# Altium project koosh_sd_card_base.PrjPcb
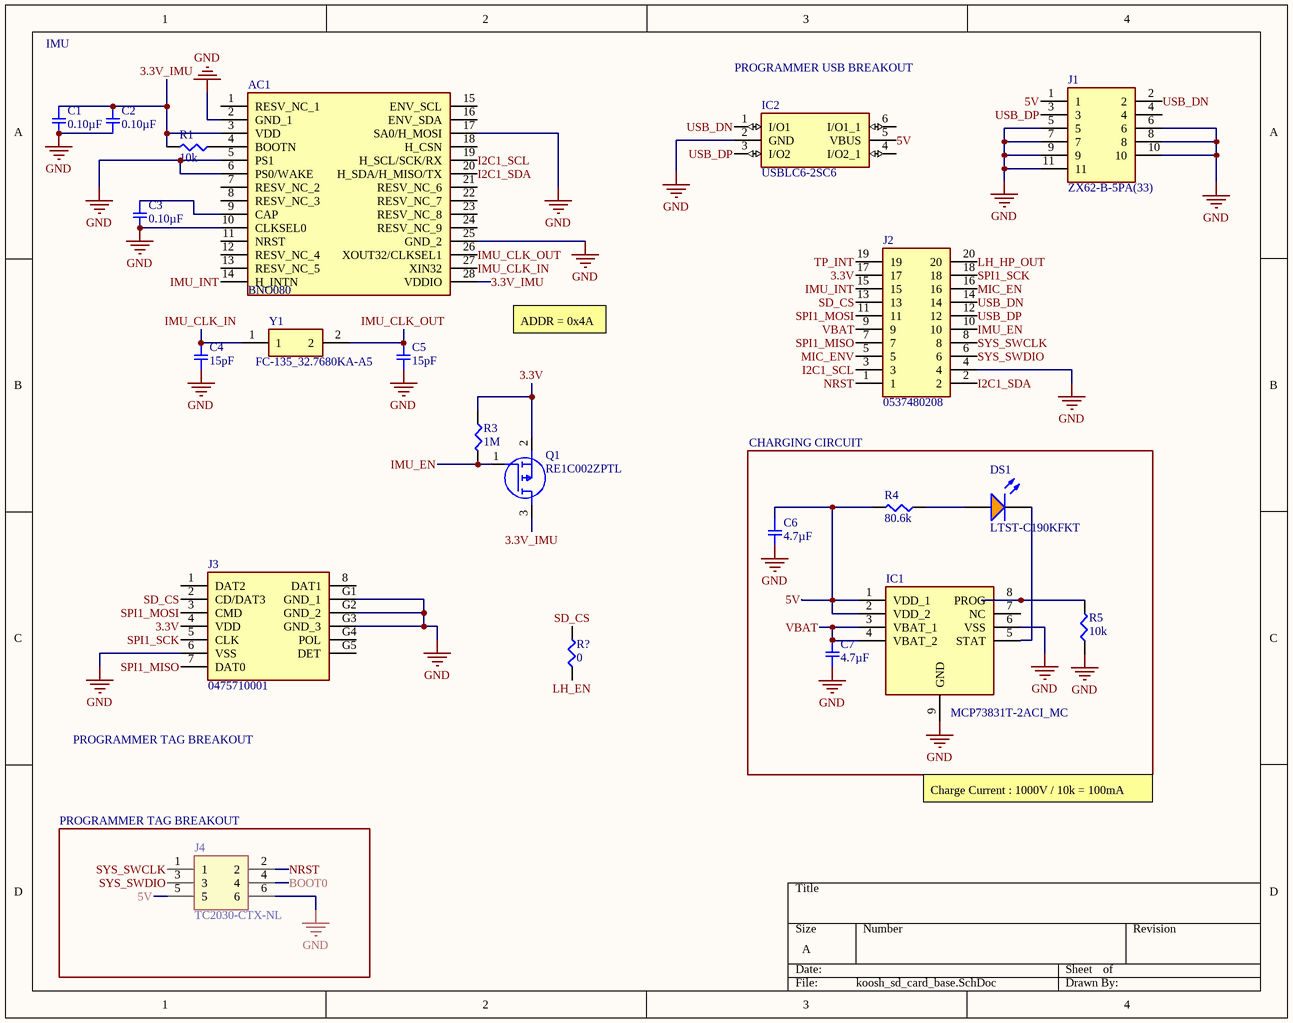
[diagram p0: koosh_sd_card_base.SchDoc]
1 sheet, 22 parts. Net scope: global (net labels, ports and power ports of the same name join across sheets).
Board file: koosh_sd_card_base_v1_1.PcbDoc

## Sheet koosh_sd_card_base.SchDoc
size A

### Parts
AC1  BNO080  [BNO080]
C1  0.10µF  [CAPC1005X55N]
C2  0.10µF  [CAPC1005X55N]
C3  0.10µF  [CAPC1005X55N]
C4  15pF  [CAPC1005X55N]
C5  15pF  [CAPC1005X55N]
C6  4.7µF  [SMD-0402C]
C7  4.7µF  [SMD-0402C]
DS1  LTST-C190KFKT  [LTST-C190KFKT_V]
IC1  MCP73831T-2ACI_MC  [SON65P300X300X100-9N-D]
IC2  USBLC6-2SC6  [SOT95P280X145-6N]
J1  ZX62-B-5PA(33)  [ZX62B5PA33]
J2  0537480208  [0537480208]
J3  0475710001  [0475710001]
J4  TC2030-CTX-NL  [TC2030MCPNL10]
Q1  RE1C002ZPTL  [SOTFL50P160X85-3N]
R1  10k  [SMD-0402-RES]
R3  1M  [SMD-0402-RES]
R4  80.6k  [SMD-0402-RES]
R5  10k  [SMD-0402-RES]
R?  0  [SMD-0402-RES]
Y1  FC-135_32.7680KA-A5  [FC135327680KAAG0]

### Blocks framed on the sheet
CHARGING CIRCUIT: C6 C7 DS1 IC1 R4 R5
PROGRAMMER TAG BREAKOUT: J4

### Nets
GND: AC1.2(GND_1) AC1.5(PS1) AC1.6(PS0/WAKE) AC1.10(CLKSEL0) AC1.17(SA0/H_MOSI) AC1.25(GND_2) C1.2 C2.2 C3.2 C4.2 C5.2 C6.2 C7.2 IC1.6(VSS) IC1.9(GND) IC2.2(GND) J1.5 J1.6 J1.7 J1.8 J1.9 J1.10 J1.11 J2.4 J3.6(VSS) J3.G1(GND_1) J3.G2(GND_2) J3.G3(GND_3) J4.6 R5.1
3.3V: J2.17 J3.4(VDD) Q1.2(S) R3.1
3.3V_IMU: AC1.3(VDD) AC1.28(VDDIO) C1.1 C2.1 Q1.3(D) R1.2
5V: C6.1 IC1.1(VDD_1) IC1.2(VDD_2) IC2.5(VBUS) J1.1 J4.5 R4.2
BOOT0: J4.4
I2C1_SCL: AC1.19(H_SCL/SCK/RX) J2.3
I2C1_SDA: AC1.20(H_SDA/H_MISO/TX) J2.2
IMU_CLK_IN: AC1.27(XIN32) C4.1 Y1.1
IMU_CLK_OUT: AC1.26(XOUT32/CLKSEL1) C5.1 Y1.2
IMU_EN: J2.10 Q1.1(G) R3.2
IMU_INT: AC1.14(H_INTN) J2.15
LH_EN: R?.1
LH_HP_OUT: J2.20
MIC_EN: J2.16
MIC_ENV: J2.5
NRST: J2.1 J4.2
SD_CS: J2.13 J3.2(CD/DAT3) R?.2
SPI1_MISO: J2.7 J3.7(DAT0)
SPI1_MOSI: J2.11 J3.3(CMD)
SPI1_SCK: J2.18 J3.5(CLK)
SYS_SWCLK: J2.8 J4.1
SYS_SWDIO: J2.6 J4.3
TP_INT: J2.19
USB_DN: IC2.1(I/O1) J1.2 J2.14
USB_DP: IC2.3(I/O2) J1.3 J2.12
VBAT: C7.1 IC1.3(VBAT_1) IC1.4(VBAT_2) J2.9
NetAC1_4: AC1.4(BOOTN) R1.1
NetAC1_9: AC1.9(CAP) C3.1
NetDS1_1: DS1.1(A) R4.1
NetDS1_2: DS1.2(K) IC1.5(STAT)
NetIC1_8: IC1.8(PROG) R5.2

Not connected (* = marked no-connect by the designer): AC1 1(RESV_NC_1) 7(RESV_NC_2) 8(RESV_NC_3) 11(NRST) 12(RESV_NC_4) 13(RESV_NC_5) 15(ENV_SCL) 16(ENV_SDA) 18(H_CSN) 21(RESV_NC_6) 22(RESV_NC_7) 23(RESV_NC_8) 24(RESV_NC_9); IC1 7(NC); IC2 4(I/O2_1) 6(I/O1_1); J1 4; J3 1(DAT2) 8(DAT1) G4(POL) G5(DET)

### Notes on the sheet
- IMU
- (near IC2) PROGRAMMER USB BREAKOUT
- ADDR = 0x4A
- PROGRAMMER TAG BREAKOUT
- Charge Current : 1000V / 10k = 100mA

### Library data of the parts
AC1 = BNO080: Accelerometer; Manufacturer_Name: Hillcrest Laboratories; Datasheet Link: http://www.hillcrestlabs.com/download/5a05f340566d07c196001ec1; Height: 1.18mm; Manufacturer_Part_Number: BNO080
C1-C3 = GCM155R71C104KA55D: CAP CER 0.1UF 16V X7R 0402; Manufacturer: Murata Electronics North America; Factory Stock: 0; Unit Price (USD): 0.1; Minimum Quantity: 1; Tolerance: ±10%; Datasheets: http://www.murata.com/~/media/webrenewal/support/library/catalog/products/capacitor/mlcc/c03e.ashx; Image: //media.digikey.com/Renders/Murata%20Renders/ZRB-SERIES-0402.jpg; Digi-Key Part Number: 490-4759-1-ND; Part Number: GCM155R71C104KA55D; Quantity Available: 734194; @ qty: 0; Packaging: Cut Tape (CT); Series: GCM; Part Status: Active; Value: 0.10µF; Voltage: 16V; Temperature Coefficient: X7R; Operating Temperature: -55°C ~ 125°C; Features: -; Ratings: AEC-Q200; Applications: Automotive; Mounting Type: Surface Mount, MLCC; Package / Case: 0402 (1005 Metric); Size / Dimension: 0.039" L x 0.020" W (1.00mm x 0.50mm); Height - Seated (Max): -; Thickness (Max): 0.022" (0.55mm); Lead Spacing: -; Lead Style: -
C4 C5 = GCM1555C1H150JA16D: CAP CER 15PF 50V NP0 0402; Manufacturer: Murata Electronics North America; Factory Stock: 0; Unit Price (USD): 0.1; Minimum Quantity: 1; Tolerance: ±5%; Temperature Coefficient: C0G, NP0; Datasheets: http://www.murata.com/~/media/webrenewal/support/library/catalog/products/capacitor/mlcc/c03e.ashx; Image: //media.digikey.com/Renders/Murata%20Renders/ZRB-SERIES-0402.jpg; Digi-Key Part Number: 490-11147-1-ND; Part Number: GCM1555C1H150JA16D; Quantity Available: 6185; @ qty: 0; Packaging: Cut Tape (CT); Series: GCM; Part Status: Active; Value: 15pF; Voltage: 50V; Operating Temperature: -55°C ~ 125°C; Features: -; Ratings: AEC-Q200; Applications: Automotive; Mounting Type: Surface Mount, MLCC; Package / Case: 0402 (1005 Metric); Size / Dimension: 0.039" L x 0.020" W (1.00mm x 0.50mm); Height - Seated (Max): -; Thickness (Max): 0.022" (0.55mm); Lead Spacing: -; Lead Style: -
C6 C7 = GRM153R60G475ME15D: CAP CER 4.7UF 4V X5R 0402; Manufacturer: Murata Electronics North America; Factory Stock: 0; Unit Price (USD): 0.27; Minimum Quantity: 1; Tolerance: ±20%; Datasheets: http://psearch.en.murata.com/capacitor/product/GRM153R60G475ME15%23.pdf; Image: //media.digikey.com/Renders/Murata%20Renders/ZRB-SERIES-0402.jpg; Digi-Key Part Number: 490-13231-1-ND; Part Number: GRM153R60G475ME15D; Quantity Available: 9100; @ qty: 0; Packaging: Cut Tape (CT); Series: GRM; Part Status: Active; Value: 4.7µF; Voltage: 4V; Temperature Coefficient: X5R; Operating Temperature: -55°C ~ 85°C; Features: -; Ratings: -; Applications: General Purpose; Mounting Type: Surface Mount, MLCC; Package / Case: 0402 (1005 Metric); Size / Dimension: 0.039" L x 0.020" W (1.00mm x 0.50mm); Height - Seated (Max): -; Thickness (Max): 0.013" (0.33mm); Lead Spacing: -; Lead Style: -
DS1 = CMP-1674-00008-1: LED Uni-Color Orange, 75 mW, 30 mA, -35 to 85 degC, 2-Pin SMD, RoHS, Tape and Reel; Resistance: 47 kohm; Power Rating: 100 mW; Case\Package: 0603; Tolerance: 1%; Voltage Rating (DC): 50 V; ComponentLink2URL: http://optoelectronics.liteon.com/upload/download/DS-22-99-0186/S_110_LTST-C190KFKT.pdf; Mount: Surface Mount; Pins: 2; Package Quantity: 5000; Max Operating Temperature: 155 degC; RoHSCompliant: true; PackageDescription: 2-Pin Surface Mount Device, Body 1.6 x 0.8 mm; Case Code (Metric): 1608; PackageReference: C190KFKT; Height: 0.45 mm; ComponentLink2Description: Datasheet; Min Operating Temperature: -55 degC; DatasheetVersion: Rev. I, 09/2011; Packaging: Tape and Reel; ComponentLink1Description: Manufacturer URL; ComponentLink1URL: http://www.us.liteon.com/; Voltage Rating: 50 V; Case Code (Imperial): 0603; Length: 1.6 mm; Width: 0.8 mm; REACH SVHC: No SVHC
IC1 = MCP73831T-2ACI_MC: Integrated Circuit; Manufacturer_Name: Microchip; Manufacturer_Part_Number: MCP73831T-2ACI/MC; Allied_Number: 70452042; Datasheet Link: http://ww1.microchip.com/downloads/en/DeviceDoc/20001984g.pdf; Height: 1mm; Mouser Part Number: 579-MCP73831T-2ACIMC; Mouser Price/Stock: https://www.mouser.com/Search/Refine.aspx?Keyword=579-MCP73831T-2ACIMC; Allied Price/Stock: https://www.alliedelec.com/microchiptechnologyinc-mcp73831t-2aci-mc/70452042/
IC2 = USBLC6-2SC6: Integrated Circuit; Manufacturer_Name: STMicroelectronics; Allied_Number: 70389689; Datasheet Link: http://www.st.com/st-web-ui/static/active/en/resource/technical/document/datasheet/CD00050750.pdf; Height: 1.45mm; Manufacturer_Part_Number: USBLC6-2SC6; Mouser Part Number: 511-USBLC6-2SC6; Mouser Price/Stock: https://www.mouser.com/Search/Refine.aspx?Keyword=511-USBLC6-2SC6; RS Part Number: 9206266; RS Price/Stock: https://uk.rs-online.com/web/p/products/9206266; Allied Price/Stock: http://www.alliedelec.com/stmicroelectronics-usblc6-2sc6/70389689/
J1 = ZX62-B-5PA(33): Connector; Manufacturer_Name: Hirose; Datasheet Link: http://www.mouser.com/ds/2/185/ZX_catalog-939768.pdf; Height: 2.8mm; Manufacturer_Part_Number: ZX62-B-5PA(33); Mouser Part Number: 798-ZX62-B-5PA33; Mouser Price/Stock: https://www.mouser.com/Search/Refine.aspx?Keyword=798-ZX62-B-5PA33; RS Part Number: 1362267; RS Price/Stock: http://uk.rs-online.com/web/p/products/1362267
J2 = 0537480208: Connector; Manufacturer_Name: Molex; Datasheet Link: https://www.molex.com/pdm_docs/sd/537480208_sd.pdf; Height: 2.6mm; Manufacturer_Part_Number: 0537480208
J3 = 0475710001: Connector; Manufacturer_Name: Molex; Datasheet Link: https://www.molex.com/pdm_docs/sd/475710001_sd.pdf; Height: 2.3mm; Manufacturer_Part_Number: 0475710001; Mouser Part Number: N/A; Mouser Price/Stock: https://www.mouser.com/Search/Refine.aspx?Keyword=N%2FA
J4 = TC2030-CTX-NL: Connector; Manufacturer_Name: Tag Connect; Datasheet Link: http://www.tag-connect.com/Materials/TC2030-CTX.pdf; Height: 18mm; Manufacturer_Part_Number: TC2030-CTX-NL
Q1 = RE1C002ZPTL: MOSFET (P-Channel); Manufacturer_Name: ROHM Semiconductor; Datasheet Link: https://componentsearchengine.com/Datasheets/1/RE1C002ZPTL.pdf; Height: 0.85mm; Manufacturer_Part_Number: RE1C002ZPTL; Mouser Part Number: 755-RE1C002ZPTL; Mouser Price/Stock: https://www.mouser.com/Search/Refine.aspx?Keyword=755-RE1C002ZPTL; RS Part Number: 1486960P; RS Price/Stock: http://uk.rs-online.com/web/p/products/1486960P
R1 R5 = ERJ-2GEJ103X: RES SMD 10K OHM 5% 1/10W 0402; Manufacturer: Panasonic Electronic Components; Factory Stock: 0; Unit Price (USD): 0.00350; @ qty: 1500; Minimum Quantity: 1; Power (Watts): 0.1W, 1/10W; Temperature Coefficient: ±200ppm/°C; Part Number: ERJ-2GEJ103X; Datasheets: http://industrial.panasonic.com/www-cgi/jvcr13pz.cgi?E+PZ+3+AOA0001+ERJ2GEJ103X+7+WW; Image: //media.digikey.com/Photos/Panasonic%20Photos/ERJ-PA2-Series.jpg; Digi-Key Part Number: P10KJCT-ND; Quantity Available: 2560215; Packaging: Cut Tape (CT); Series: ERJ; Part Status: Active; Value: 10k; Tolerance: ±5%; Composition: Thick Film; Features: Automotive AEC-Q200; Operating Temperature: -55°C ~ 155°C; Package / Case: 0402 (1005 Metric); Supplier Device Package: 0402; Size / Dimension: 0.039" L x 0.020" W (1.00mm x 0.50mm); Height - Seated (Max): 0.016" (0.40mm); Number of Terminations: 2; Failure Rate: -
R3 = ERJ-2GEJ105X: RES SMD 1M OHM 5% 1/10W 0402; Manufacturer: Panasonic Electronic Components; Factory Stock: 0; Unit Price (USD): 0.00350; @ qty: 1500; Minimum Quantity: 1; Power (Watts): 0.1W, 1/10W; Temperature Coefficient: ±200ppm/°C; Part Number: ERJ-2GEJ105X; Datasheets: http://industrial.panasonic.com/www-cgi/jvcr13pz.cgi?E+PZ+3+AOA0001+ERJ2GEJ105X+7+WW; Image: //media.digikey.com/Photos/Panasonic%20Photos/ERJ-PA2-Series.jpg; Digi-Key Part Number: P1.0MJCT-ND; Quantity Available: 1082572; Packaging: Cut Tape (CT); Series: ERJ; Part Status: Active; Value: 1M; Tolerance: ±5%; Composition: Thick Film; Features: Automotive AEC-Q200; Operating Temperature: -55°C ~ 155°C; Package / Case: 0402 (1005 Metric); Supplier Device Package: 0402; Size / Dimension: 0.039" L x 0.020" W (1.00mm x 0.50mm); Height - Seated (Max): 0.016" (0.40mm); Number of Terminations: 2; Failure Rate: -
R4 = ERJ-2RKF8062X: RES SMD 80.6K OHM 1% 1/10W 0402; Manufacturer: Panasonic Electronic Components; Factory Stock: 0; Unit Price (USD): 0.00496; @ qty: 1500; Minimum Quantity: 1; Power (Watts): 0.1W, 1/10W; Temperature Coefficient: ±100ppm/°C; Part Number: ERJ-2RKF8062X; Datasheets: http://industrial.panasonic.com/www-cgi/jvcr13pz.cgi?E+PZ+3+AOA0002+ERJ2RKF8062X+7+WW; Image: //media.digikey.com/Photos/Panasonic%20Photos/ERJ-PA2-Series.jpg; Digi-Key Part Number: P80.6KLCT-ND; Quantity Available: 91747; Packaging: Cut Tape (CT); Series: ERJ; Part Status: Active; Value: 80.6k; Tolerance: ±1%; Composition: Thick Film; Features: Automotive AEC-Q200; Operating Temperature: -55°C ~ 155°C; Package / Case: 0402 (1005 Metric); Supplier Device Package: 0402; Size / Dimension: 0.039" L x 0.020" W (1.00mm x 0.50mm); Height - Seated (Max): 0.016" (0.40mm); Number of Terminations: 2; Failure Rate: -
R? = ERJ-2RKF1003X: RES SMD 0 OHM 1% 1/10W 0402; Manufacturer: Panasonic Electronic Components; Unit Price (USD): 0.00496; @ qty: 1500; Minimum Quantity: 1; Power (Watts): 0.1W, 1/10W; Temperature Coefficient: ±100ppm/°C; Part Number: ERJ-2RKF1003X; Datasheets: http://industrial.panasonic.com/www-cgi/jvcr13pz.cgi?E+PZ+3+AOA0002+ERJ2RKF1003X+7+WW; Image: //media.digikey.com/Photos/Panasonic%20Photos/ERJ-PA2-Series.jpg; Digi-Key Part Number: P100KLCT-ND; Quantity Available: 2645965; Factory Stock: 0; Packaging: Cut Tape (CT); Series: ERJ; Part Status: Active; Value: 0; Tolerance: ±1%; Composition: Thick Film; Features: Automotive AEC-Q200; Operating Temperature: -55°C ~ 155°C; Package / Case: 0402 (1005 Metric); Supplier Device Package: 0402; Size / Dimension: 0.039" L x 0.020" W (1.00mm x 0.50mm); Height - Seated (Max): 0.016" (0.40mm); Number of Terminations: 2; Failure Rate: -
Y1 = FC-135_32.7680KA-A3: Crystal or Oscillator; Manufacturer_Name: Epson Timing; Manufacturer_Part_Number: FC-135 32.7680KA-A5; Datasheet Link: https://support.epson.biz/td/api/doc_check.php?dl=brief_fc-135r_en.pdf; Height: 0mm; Mouser Part Number: 732-FC135-32.76KAA3; Mouser Price/Stock: https://www.mouser.com/Search/Refine.aspx?Keyword=732-FC135-32.76KAA3